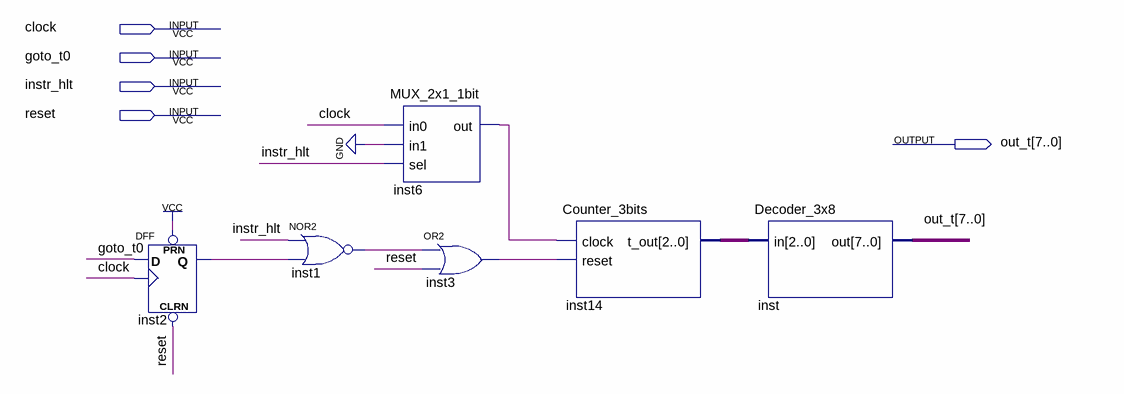
[diagram p0: schematic sheet]
// Quartus schematic Timer.bdf as structural Verilog: 6 symbols, 5 pins
module Timer (
  input  clock,
  input  goto_t0,
  input  instr_hlt,
  input  reset,
  output [7:0] out_t
);

  wire inst1_out, inst2_q, inst3_out, inst6_out;
  wire [2:0] inst14_t_out;

  DFF inst2 (.CLRN(reset), .CLK(clock), .D(goto_t0), .PRN(1'b1), .Q(inst2_q));
  nor inst1 (inst1_out, instr_hlt, inst2_q);
  MUX_2x1_1bit inst6 (.in0(clock), .in1(1'b0), .sel(instr_hlt), .out(inst6_out));
  or inst3 (inst3_out, inst1_out, reset);
  Counter_3bits inst14 (.clock(inst6_out), .reset(inst3_out), .t_out(inst14_t_out));
  Decoder_3x8 inst (.in(inst14_t_out), .out(out_t));
endmodule
